# EAGLE design TracktorDash-sm-XIAO-XBee (EAGLE 9.6.2)
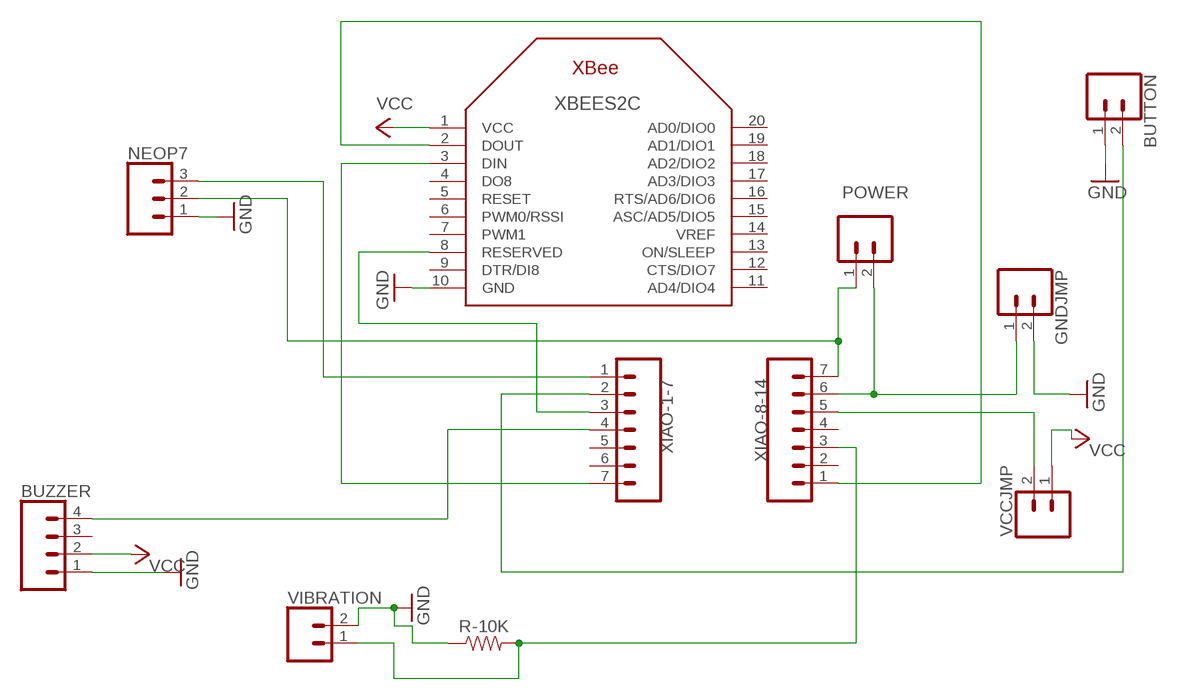
[diagram p0: schematic, sheet 1]

## Parts
BUTTON  CONN_02  [1X02]
BUZZER  CONN_041X04_NO_SILK  [1X04_NO_SILK]
GNDJMP  CONN_02  [1X02]
NEOP7  455-1750-1-ND  CONN_03  [1X03]
POWER  CONN_02  [1X02]
R-10K  10  10OHM-HORIZ-1/4W-1%  [AXIAL-0.3]
VCCJMP  CONN_02  [1X02]
VIBRATION  CONN_02  [1X02]
XBEES2C  XBEE  [XBEE]
XIAO-1-7  CONN_07  [1X07]
XIAO-8-14  CONN_07  [1X07]

## Nets
GND: BUTTON.1 BUZZER.1 GNDJMP.2 NEOP7.1 R-10K.P$1 VIBRATION.2 XBEES2C.10(GND)
N$1: NEOP7.3 XIAO-1-7.1
N$2: VCCJMP.2 XIAO-8-14.5
N$3: XBEES2C.3(DIN) XIAO-1-7.7
N$4: BUTTON.2 XIAO-1-7.2
N$5: XBEES2C.8(RESERVED) XIAO-1-7.3
N$6: BUZZER.4 XIAO-1-7.4
N$8: NEOP7.2 POWER.1 XIAO-8-14.7
N$9: XBEES2C.2(DOUT) XIAO-8-14.1
N$11: R-10K.P$2 VIBRATION.1 XIAO-8-14.3
N$12: GNDJMP.1 POWER.2 XIAO-8-14.6
VCC: BUZZER.2 VCCJMP.1 XBEES2C.1(VCC)
Unconnected: BUZZER.3 XBEES2C.4(DO8) XBEES2C.5(RESET) XBEES2C.6(PWM0/RSSI) XBEES2C.7(PWM1) XBEES2C.9(DTR/DI8) XBEES2C.11(AD4/DIO4) XBEES2C.12(CTS/DIO7) XBEES2C.13(ON/SLEEP) XBEES2C.14(VREF) XBEES2C.15(ASC/AD5/DIO5) XBEES2C.16(RTS/AD6/DIO6) XBEES2C.17(AD3/DIO3) XBEES2C.18(AD2/DIO2) XBEES2C.19(AD1/DIO1) XBEES2C.20(AD0/DIO0) XIAO-1-7.5 XIAO-1-7.6 XIAO-8-14.2 XIAO-8-14.4

## Library data of the parts
BUTTON GNDJMP POWER VCCJMP VIBRATION = SparkFun-Connectors:CONN_02: Multi connection point. Often used as Generic Header-pin footprint for 0.1 inch spaced/style header connections On any of the 0.1 inch spaced packages, you can populate with these: Break Away Headers - Straight <https://www.sparkfun.com/products/116> (PRT-00116) Break Away Male Headers - Right Angle <https://www.sparkfun.com/products/553> (PRT-00553) Female Headers <https://www.sparkfun.com/products/115> (PRT-00115) Break Away Headers - Machine Pin <https://www.sparkfun.com/products/117> (PRT-00117) Break Away Female Headers - Swiss Machine Pin <https://www.sparkfun.com/products/743> (PRT-00743) For SCREWTERMINALS and SPRING TERMINALS visit here: Screw Terimnals on SparkFun.com <https://www.sparkfun.com/search/results?term=Screw+Terminals> (5mm/3.5mm/2.54mm spacing) This device is also useful as a general connection point to wire up your design to another part of your project. Our various solder wires solder well into these plated through hole pads. Hook-Up Wire - Assortment (Stranded, 22 AWG) <https://www.sparkfun.com/products/11375> (PRT-11375) Hook-Up Wire - Assortment (Solid Core, 22 AWG) <https://www.sparkfun.com/products/11367> (PRT-11367) View the entire wire category on our website here <https://www.sparkfun.com/categories/141> Special notes: Molex polarized connector foot print use with: PRT-08233 with associated crimp pins and housings. 2.54_SCREWTERM for use with PRT-10571. 3.5mm Screw Terminal footprints for PRT-08084 5mm Screw Terminal footprints for use with PRT-08432
BUZZER = SparkFun-Connectors:CONN_04: Multi connection point. Often used as Generic Header-pin footprint for 0.1 inch spaced/style header connections On any of the 0.1 inch spaced packages, you can populate with these: Break Away Headers - Straight <https://www.sparkfun.com/products/116> (PRT-00116) Break Away Male Headers - Right Angle <https://www.sparkfun.com/products/553> (PRT-00553) Female Headers <https://www.sparkfun.com/products/115> (PRT-00115) Break Away Headers - Machine Pin <https://www.sparkfun.com/products/117> (PRT-00117) Break Away Female Headers - Swiss Machine Pin <https://www.sparkfun.com/products/743> (PRT-00743) For SCREWTERMINALS and SPRING TERMINALS visit here: Screw Terimnals on SparkFun.com <https://www.sparkfun.com/search/results?term=Screw+Terminals> (5mm/3.5mm/2.54mm spacing) This device is also useful as a general connection point to wire up your design to another part of your project. Our various solder wires solder well into these plated through hole pads. Hook-Up Wire - Assortment (Stranded, 22 AWG) <https://www.sparkfun.com/products/11375> (PRT-11375) Hook-Up Wire - Assortment (Solid Core, 22 AWG) <https://www.sparkfun.com/products/11367> (PRT-11367) View the entire wire category on our website here <https://www.sparkfun.com/categories/141> Special notes: Molex polarized connector foot print use with SKU : PRT-08231 with associated crimp pins and housings. 1MM SMD Version SKU: PRT-10208; PROD_ID: CONN-09696
NEOP7 = SparkFun-Connectors:CONN_03: Multi connection point. Often used as Generic Header-pin footprint for 0.1 inch spaced/style header connections On any of the 0.1 inch spaced packages, you can populate with these: Break Away Headers - Straight <https://www.sparkfun.com/products/116> (PRT-00116) Break Away Male Headers - Right Angle <https://www.sparkfun.com/products/553> (PRT-00553) Female Headers <https://www.sparkfun.com/products/115> (PRT-00115) Break Away Headers - Machine Pin <https://www.sparkfun.com/products/117> (PRT-00117) Break Away Female Headers - Swiss Machine Pin <https://www.sparkfun.com/products/743> (PRT-00743) Stackable Header - 3 Pin (Female, 0.1") <https://www.sparkfun.com/products/13875> (PRT-13875) For SCREWTERMINALS and SPRING TERMINALS visit here: Screw Terimnals on SparkFun.com <https://www.sparkfun.com/search/results?term=Screw+Terminals> (5mm/3.5mm/2.54mm spacing) This device is also useful as a general connection point to wire up your design to another part of your project. Our various solder wires solder well into these plated through hole pads. Hook-Up Wire - Assortment (Stranded, 22 AWG) <https://www.sparkfun.com/products/11375> (PRT-11375) Hook-Up Wire - Assortment (Solid Core, 22 AWG) <https://www.sparkfun.com/products/11367> (PRT-11367) View the entire wire category on our website here <https://www.sparkfun.com/categories/141> Special notes: Molex polarized connector foot print use with SKU : PRT-08232 with associated crimp pins and housings.; PROD_ID: XXX-00000
R-10K = SparkFun-Resistors:10OHM: 10Ω resistor A resistor is a passive two-terminal electrical component that implements electrical resistance as a circuit element. Resistors act to reduce current flow, and, at the same time, act to lower voltage levels within circuits. - Wikipedia; PROD_ID: RES-12180
XBEES2C = adafruit:XBEE
XIAO-1-7 XIAO-8-14 = SparkFun-Connectors:CONN_07: Multi connection point. Often used as Generic Header-pin footprint for 0.1 inch spaced/style header connections On any of the 0.1 inch spaced packages, you can populate with these: Break Away Headers - Straight <https://www.sparkfun.com/products/116> (PRT-00116) Break Away Male Headers - Right Angle <https://www.sparkfun.com/products/553> (PRT-00553) Female Headers <https://www.sparkfun.com/products/115> (PRT-00115) Break Away Headers - Machine Pin <https://www.sparkfun.com/products/117> (PRT-00117) Break Away Female Headers - Swiss Machine Pin <https://www.sparkfun.com/products/743> (PRT-00743) For SCREWTERMINALS and SPRING TERMINALS visit here: Screw Terimnals on SparkFun.com <https://www.sparkfun.com/search/results?term=Screw+Terminals> (5mm/3.5mm/2.54mm spacing) This device is also useful as a general connection point to wire up your design to another part of your project. Our various solder wires solder well into these plated through hole pads. Hook-Up Wire - Assortment (Stranded, 22 AWG) <https://www.sparkfun.com/products/11375> (PRT-11375) Hook-Up Wire - Assortment (Solid Core, 22 AWG) <https://www.sparkfun.com/products/11367> (PRT-11367) View the entire wire category on our website here <https://www.sparkfun.com/categories/141> Special notes: Molex polarized connector foot print use with SKU : PRT-08231 with associated crimp pins and housings. 1MM SMD Version SKU: PRT-10208 NOTES ON THE VARIANTS LOCK and LOCK_LONGPADS... This footprint was designed to help hold the alignment of a through-hole component (i.e. 6-pin header) while soldering it into place. You may notice that each hole has been shifted either up or down by 0.005 of an inch from it's more standard position (which is a perfectly straight line). This slight alteration caused the pins (the squares in the middle) to touch the edges of the holes. Because they are alternating, it causes a "brace" to hold the component in place. 0.005 has proven to be the perfect amount of "off-center" position when using our standard breakaway headers. Although looks a little odd when you look at the bare footprint, once you have a header in there, the alteration is very hard to notice. Also,if you push a header all the way into place, it is covered up entirely on the bottom side.

## Net classes
0 default: width 0.305 mm, drill 0.508 mm, clearance 0.508 mm

## Board
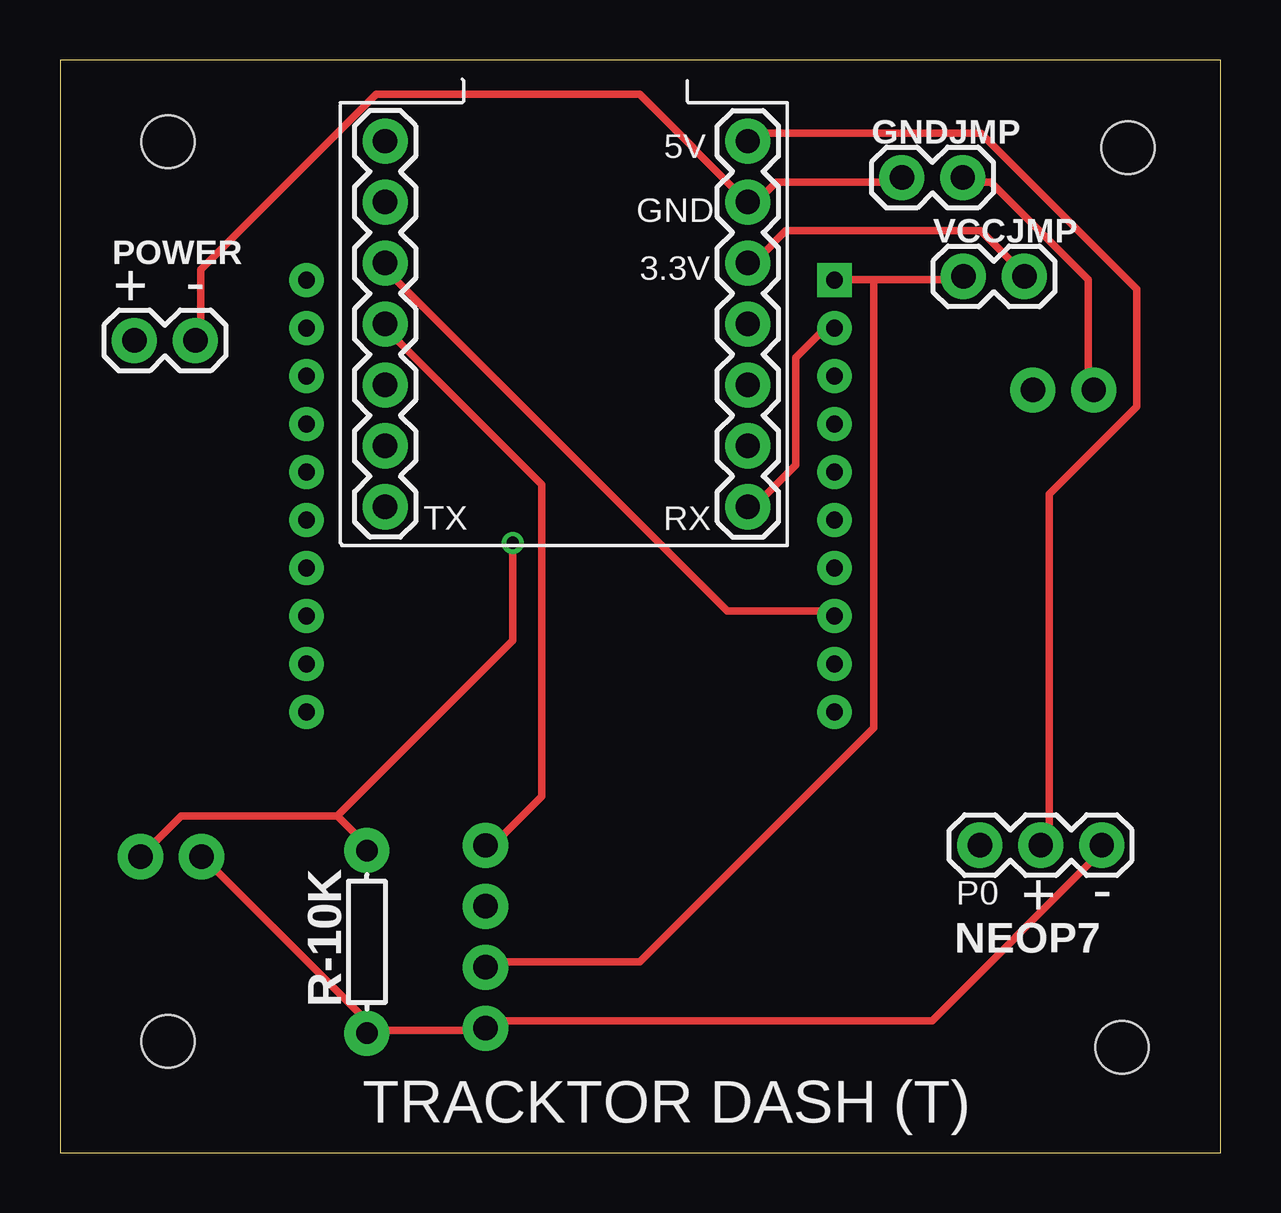
[diagram p1: board, top side]
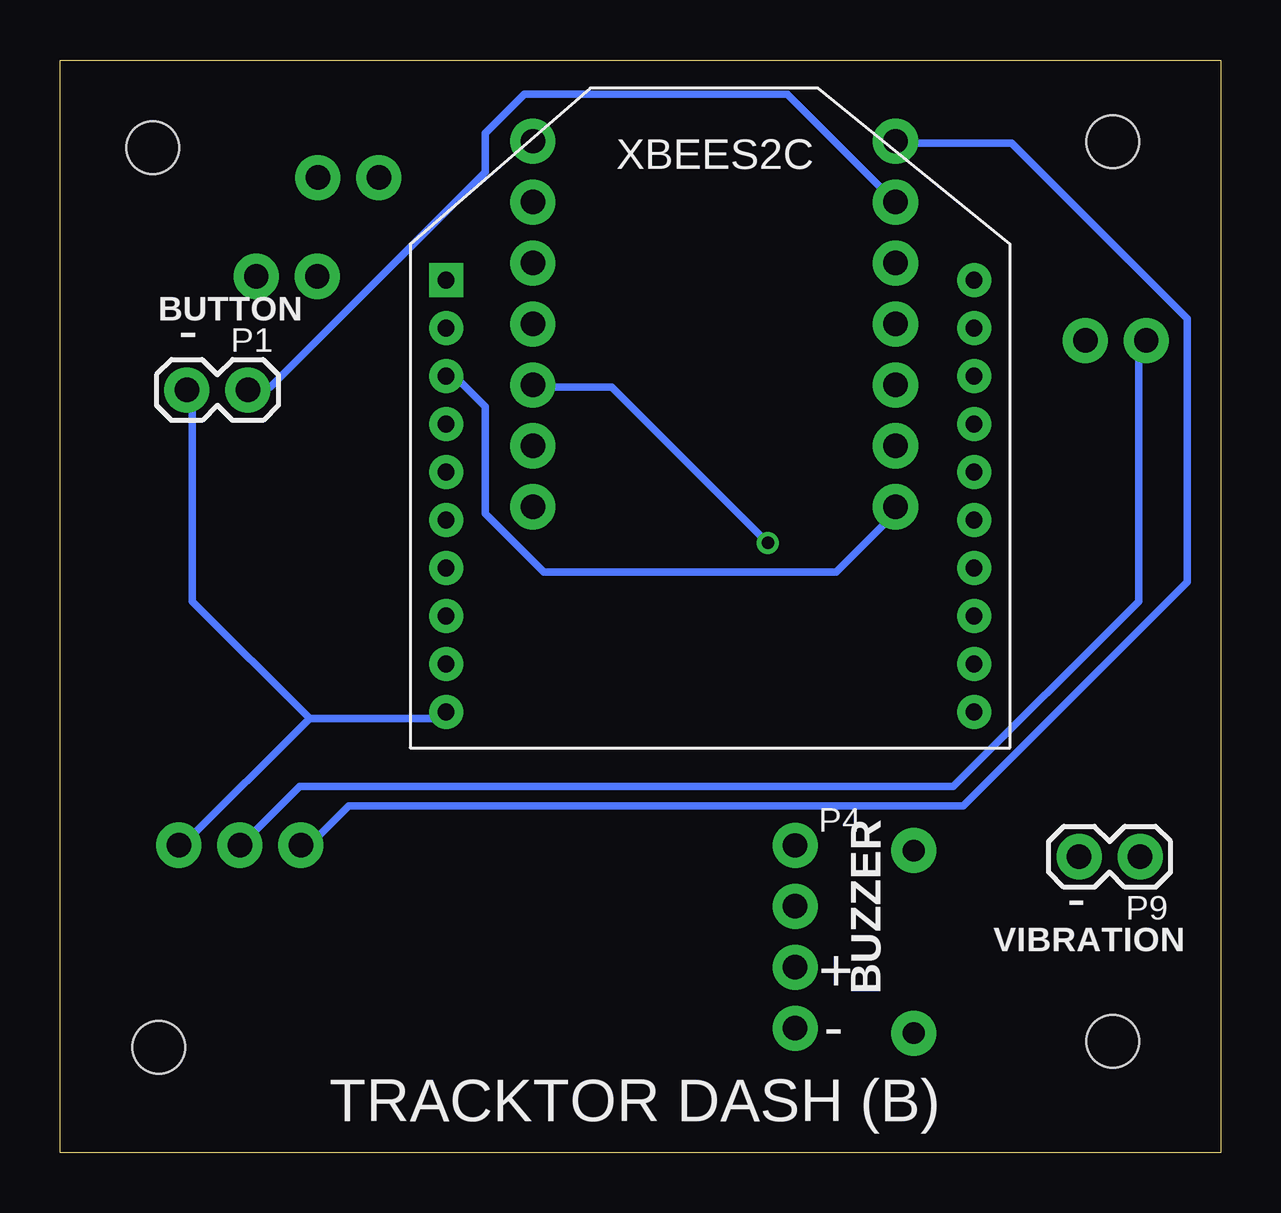
[diagram p2: board, bottom side, seen from below]

Size 48.36 x 45.56 mm. Coordinates in mm from the lower left corner, seen from the top.
Outline: 0,0 48.36,0 48.36,45.56 0,45.56 0,0
Copper layers (1*16): Top 0.035mm / dielectric 1.5mm / Bottom 0.035mm
Design rules "default": minimum track width 6mil, minimum drill 0.35mm, track to track 6mil, track to pad 6mil, pad to pad 6mil, via to via 6mil, smd to smd 6mil, copper to edge 40mil, drill to drill 6mil, minimum pad ring 10mil, minimum via ring 8mil, stop-mask expansion 4mil, vias tented up to drill 0mil, thermal gap 10mil
Holes 2.2 mm at 4.5,42.15 44.5,41.9 44.25,4.4 4.5,4.65

### Footprints (pad centres in the part's own frame; a part is rotated, then mirrored left to right if it is on the bottom)
1X02 = drill 1.016 pad 1.88: 1 0,0; 2 2.54,0
1X04_NO_SILK = drill 1.016 pad 1.88: 1 0,0; 2 2.54,0; 3 5.08,0; 4 7.62,0
1X03 = drill 1.016 pad 1.88: 1 0,0; 2 2.54,0; 3 5.08,0
AXIAL-0.3 = drill 0.9 pad 1.88: P$1 -3.81,0; P$2 3.81,0
XBEE = drill 0.7 pad 1.422 square: 1 -11,5.5 | drill 0.7 pad 1.422: 2 -11,3.5; 3 -11,1.5; 4 -11,-0.5; 5 -11,-2.5; 6 -11,-4.5; 7 -11,-6.5; 8 -11,-8.5; 9 -11,-10.5; 10 -11,-12.5; 11 11,-12.5; 12 11,-10.5; 13 11,-8.5; 14 11,-6.5; 15 11,-4.5; 16 11,-2.5; 17 11,-0.5; 18 11,1.5; 19 11,3.5; 20 11,5.5
1X07 = drill 1.016 pad 1.88: 1 0,0; 2 2.54,0; 3 5.08,0; 4 7.62,0; 5 10.16,0; 6 12.7,0; 7 15.24,0

### Placement (x,y rotation side)
BUTTON  43.07,31.8 0 bottom
BUZZER  17.73,5.2 90 bottom
GNDJMP  35.08,40.66 0 top
NEOP7  43.41,12.83 180 top
POWER  3.1,33.87 0 top
R-10K  12.79,8.8 90 top
VCCJMP  37.64,36.54 0 top
VIBRATION  3.36,12.35 180 bottom
XBEES2C  21.27,30.89 0 bottom
XIAO-1-7  13.55,42.18 270 top
XIAO-8-14  28.66,26.94 90 top

### Tracks (layer width: path | path; a pad name or v marks a point on that pad's centre or on a via)
GND
  Top 0.305: 13.17,5.11 17.64,5.11 BUZZER.1 18.05,5.52 36.34,5.52 43.25,12.43 NEOP7.1 | 13.17,5.11 6.26,12.02 VIBRATION.2 | 13.17,5.11 R-10K.P$1 | GNDJMP.2 37.96,40.47 38.78,40.47 42.84,36.41 42.84,31.94 BUTTON.1
  Bottom 0.305: 37.96,18.12 32.27,18.12 XBEES2C.10 | 37.96,18.12 43.25,12.83 NEOP7.1 | 37.96,18.12 42.84,23 42.84,31.53 BUTTON.1
N$1
  Bottom 0.305: XIAO-1-7.1 13.17,42.1 8.7,42.1 1.39,34.78 1.39,23.81 10.73,14.46 36.34,14.46 37.96,12.83 NEOP7.3
N$2
  Top 0.305: VCCJMP.2 40,36.81 38.37,38.44 30.24,38.44 29.02,37.22 XIAO-8-14.5
N$3
  Bottom 0.305: XBEES2C.3 31.87,32.34 30.65,31.12 30.65,26.65 28.21,24.21 16.02,24.21 13.58,26.65 XIAO-1-7.7
N$4
  Bottom 0.305: BUTTON.2 40.4,31.94 39.59,31.94 30.65,40.88 30.65,42.5 29.02,44.13 18.05,44.13 13.58,39.66 XIAO-1-7.2
N$5
  Top 0.305: XBEES2C.8 31.87,22.59 27.8,22.59 13.58,36.81 XIAO-1-7.3
N$6
  Top 0.305: XIAO-1-7.4 13.58,34.37 20.08,27.87 20.08,14.87 18.05,12.83 BUZZER.4
N$8
  Top 0.305: NEOP7.2 41.21,12.83 41.21,27.47 44.87,31.12 44.87,36 38.37,42.5 29.02,42.5 XIAO-8-14.7
  Bottom 0.305: POWER.1 3.42,33.56 3.42,23 11.14,15.27 38.37,15.27 40.81,12.83 NEOP7.2
N$9
  Top 0.305: XBEES2C.2 31.87,34.37 30.65,33.16 30.65,28.68 29.02,27.06 XIAO-8-14.1
N$11  (via drill 0.51)
  Top 0.305: 11.55,14.05 5.04,14.05 3.42,12.43 VIBRATION.1 | 11.55,14.05 12.77,12.83 R-10K.P$2 | v18.86,25.43 18.86,21.37 11.55,14.05
  Bottom 0.305: v18.86,25.43 25.37,31.94 28.62,31.94 XIAO-8-14.3
N$12
  Top 0.305: POWER.2 5.86,33.97 5.86,36.81 13.17,44.13 24.15,44.13 28.62,39.66 XIAO-8-14.6 29.02,39.66 29.84,40.47 34.71,40.47 GNDJMP.1
VCC
  Top 0.305: 33.9,36.41 37.56,36.41 VCCJMP.1 | 33.9,36.41 32.27,36.41 XBEES2C.1 | 33.9,36.41 33.9,17.71 24.15,7.96 18.05,7.96 BUZZER.2

### Text on the board
tNames: 5V | GND | 3.3V | + | - | TX | RX | P0 | + | - | TRACKTOR DASH (T)
bNames: P1 | - | P4 | P9 | - | + | - | TRACKTOR DASH (B)